# Altium schematic sheet 1.AMM592.SchDoc: 1.AM_Starter_kit_V003
size A4; DrawnBy: Mason; Revision: V003; SheetNumber: 1; SheetTotal: 2; Team: Gateway; ProjectName: AM_Starter_kit_V003
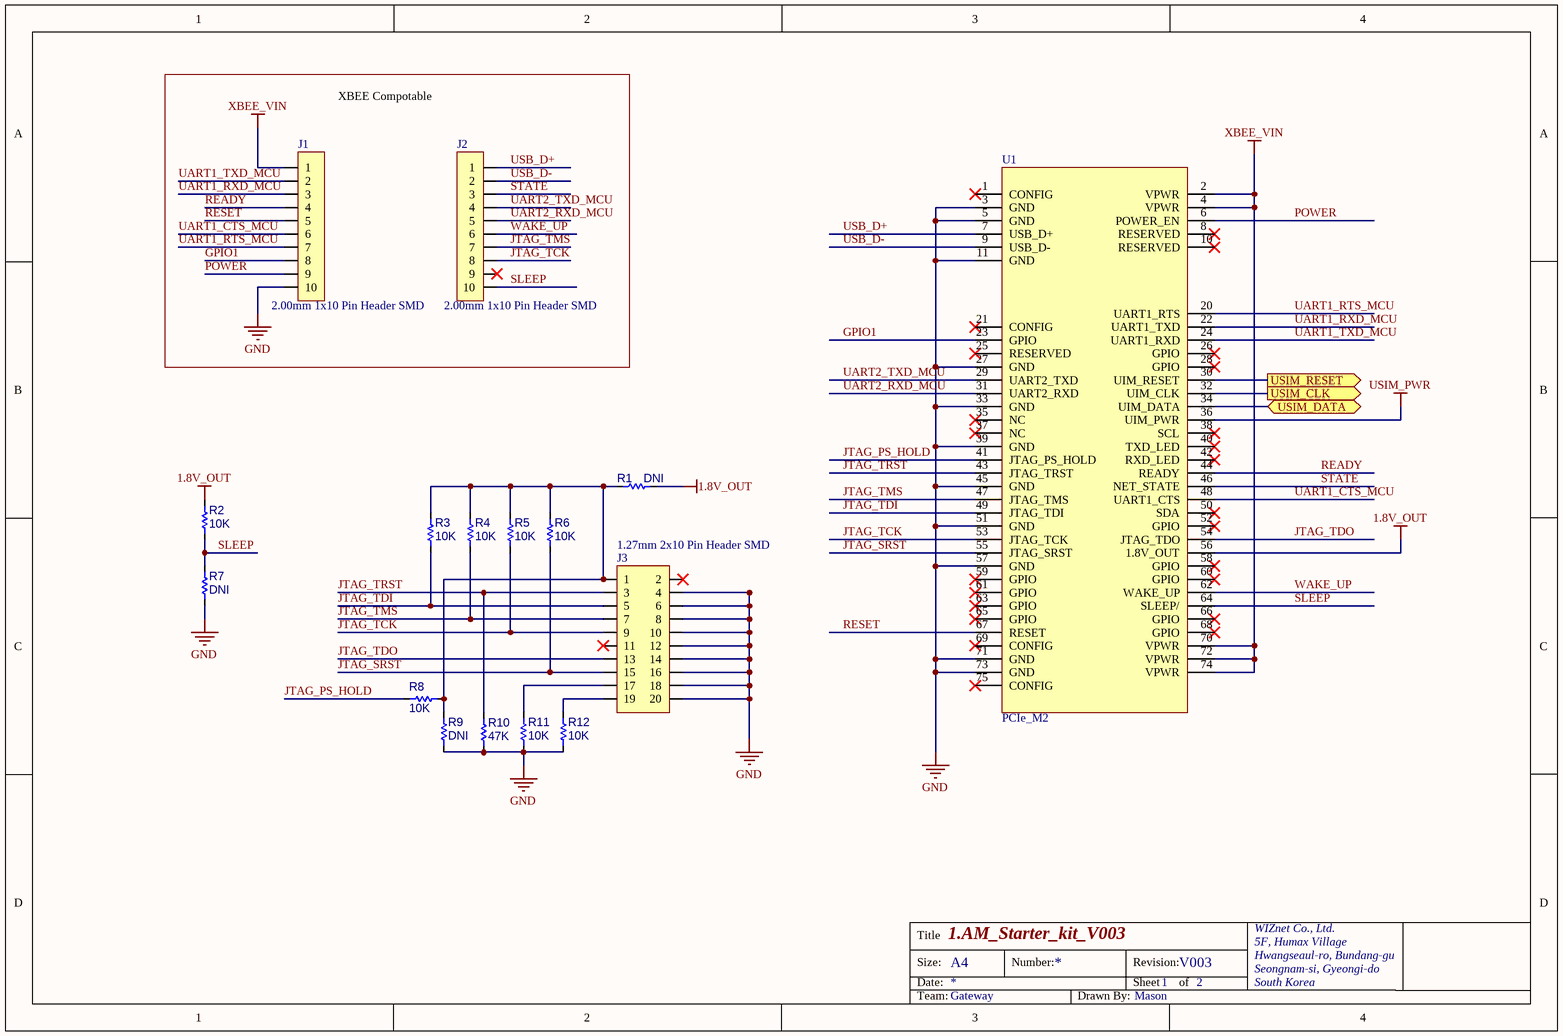
[diagram p0: 1.AMM592.SchDoc]

## Parts
J1  2.00mm 1x10 Pin Header SMD  [IDC(SMD)-1X10(2MM)]
J2  2.00mm 1x10 Pin Header SMD  [IDC(SMD)-1X10(2MM)]
J3  1.27mm 2x10 Pin Header SMD  [IDC(SMD)-2X10(1.27MM)]
R1  DNI  [RES-0402]
R2  10K  [RES-0402]
R3  10K  [RES-0402]
R4  10K  [RES-0402]
R5  10K  [RES-0402]
R6  10K  [RES-0402]
R7  DNI  [RES-0402]
R8  10K  [RES-0402]
R9  DNI  [RES-0402]
R10  47K  [RES-0402]
R11  10K  [RES-0402]
R12  10K  [RES-0402]
U1  PCIe_M2  [PCIe_M2]

## Ports
USIM_CLK (out), USIM_DATA (bidir), USIM_RESET (out)

## Nets
1.8V_OUT: R1.1 R2.2 U1.56(1.8V_OUT)
GND: J1.10 J3.4 J3.6 J3.8 J3.10 J3.12 J3.14 J3.16 J3.18 J3.20 R7.1 R9.1 R10.1 R11.1 R12.1 U1.3(GND) U1.5(GND) U1.11(GND) U1.27(GND) U1.33(GND) U1.39(GND) U1.45(GND) U1.51(GND) U1.57(GND) U1.71(GND) U1.73(GND)
USIM_PWR: U1.36(UIM_PWR)
XBEE_VIN: J1.1 U1.2(VPWR) U1.4(VPWR) U1.70(VPWR) U1.72(VPWR) U1.74(VPWR)
GPIO1: J1.8 U1.23(GPIO)
JTAG_PS_HOLD: R8.2 U1.41(JTAG_PS_HOLD)
JTAG_SRST: J3.15 R6.1 U1.55(JTAG_SRST)
JTAG_TCK: J2.8 J3.9 R5.1 U1.53(JTAG_TCK)
JTAG_TDI: J3.5 R3.1 U1.49(JTAG_TDI)
JTAG_TDO: J3.13 U1.54(JTAG_TDO)
JTAG_TMS: J2.7 J3.7 R4.1 U1.47(JTAG_TMS)
JTAG_TRST: J3.3 R10.2 U1.43(JTAG_TRST)
POWER: J1.9 U1.6(POWER_EN)
READY: J1.4 U1.44(READY)
RESET: J1.5 U1.67(RESET)
SLEEP: J2.10 R2.1 R7.2 U1.64(SLEEP/)
STATE: J2.3 U1.46(NET_STATE)
UART1_CTS_MCU: J1.6 U1.48(UART1_CTS)
UART1_RTS_MCU: J1.7 U1.20(UART1_RTS)
UART1_RXD_MCU: J1.3 U1.22(UART1_TXD)
UART1_TXD_MCU: J1.2 U1.24(UART1_RXD)
UART2_RXD_MCU: J2.5 U1.31(UART2_RXD)
UART2_TXD_MCU: J2.4 U1.29(UART2_TXD)
USB_D+: J2.1 U1.7(USB_D+)
USB_D-: J2.2 U1.9(USB_D-)
USIM_CLK: U1.32(UIM_CLK) ; port USIM_CLK
USIM_DATA: U1.34(UIM_DATA) ; port USIM_DATA
USIM_RESET: U1.30(UIM_RESET) ; port USIM_RESET
WAKE_UP: J2.6 U1.62(WAKE_UP)
NetJ3_1: J3.1 R1.2 R3.2 R4.2 R5.2 R6.2 R8.1 R9.2
NetJ3_17: J3.17 R11.2
NetJ3_19: J3.19 R12.2

Not connected (* = marked no-connect by the designer): J2 9*; J3 2* 11*; U1 1(CONFIG)* 8(RESERVED)* 10(RESERVED)* 21(CONFIG)* 25(RESERVED)* 26(GPIO)* 28(GPIO)* 35(NC)* 37(NC)* 38(SCL)* 40(TXD_LED)* 42(RXD_LED)* 50(SDA)* 52(GPIO)* 58(GPIO)* 59(GPIO)* 60(GPIO)* 61(GPIO)* 63(GPIO)* 65(GPIO)* 66(GPIO)* 68(GPIO)* 69(CONFIG)* 75(CONFIG)*

## Notes on the sheet
- XBEE Compotable
- Title
- Size:
- Date:
- A4
- Number:
- Revision:
- Sheet
- of
- WIZnet Co., Ltd.
- 5F, Humax Village
- Hwangseaul-ro, Bundang-gu
- Seongnam-si, Gyeongi-do
- South Korea
- Team:
- Drawn By:

## Library data of the parts
R1-R12 = RES-0402
U1 = PCIe-M2